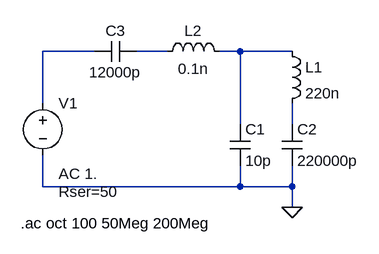
[diagram p0: schematic freq response1.asc]
freq response1.asc, the LTspice schematic file:
Version 4
SHEET 1 880 680
WIRE -112 96 -192 96
WIRE 0 96 -48 96
WIRE 112 96 80 96
WIRE 192 96 112 96
WIRE -192 176 -192 96
WIRE 112 208 112 96
WIRE 192 208 192 176
WIRE -192 304 -192 256
WIRE 112 304 112 272
WIRE 112 304 -192 304
WIRE 192 304 192 272
WIRE 192 304 112 304
WIRE 192 336 192 304
FLAG 192 336 0
SYMBOL ind 176 80 R0
SYMATTR InstName L1
SYMATTR Value 220n
SYMATTR SpiceLine Rser=1
SYMBOL ind -16 112 R270
WINDOW 0 32 56 VTop 2
WINDOW 3 5 56 VBottom 2
SYMATTR InstName L2
SYMATTR Value 0.1n
SYMATTR SpiceLine Rser=1
SYMBOL cap 96 208 R0
SYMATTR InstName C1
SYMATTR Value 10p
SYMBOL cap 176 208 R0
SYMATTR InstName C2
SYMATTR Value 220000p
SYMBOL cap -48 80 R90
WINDOW 0 0 32 VBottom 2
WINDOW 3 32 32 VTop 2
SYMATTR InstName C3
SYMATTR Value 12000p
SYMBOL voltage -192 160 R0
WINDOW 123 24 124 Left 2
WINDOW 39 24 152 Left 2
SYMATTR InstName V1
SYMATTR Value ""
SYMATTR Value2 AC 1.
SYMATTR SpiceLine Rser=50
TEXT -226 360 Left 2 !.ac oct 100 50Meg 200Meg

The netlist it stands for:
* freq response1.asc
L1 N003 N004 220n Rser=1
L2 N002 N003 0.1n Rser=1
C1 N003 0 10p
C2 N004 0 220000p
C3 N002 N001 12000p
V1 N001 0 AC 1. Rser=50
.ac oct 100 50Meg 200Meg
.backanno
.end